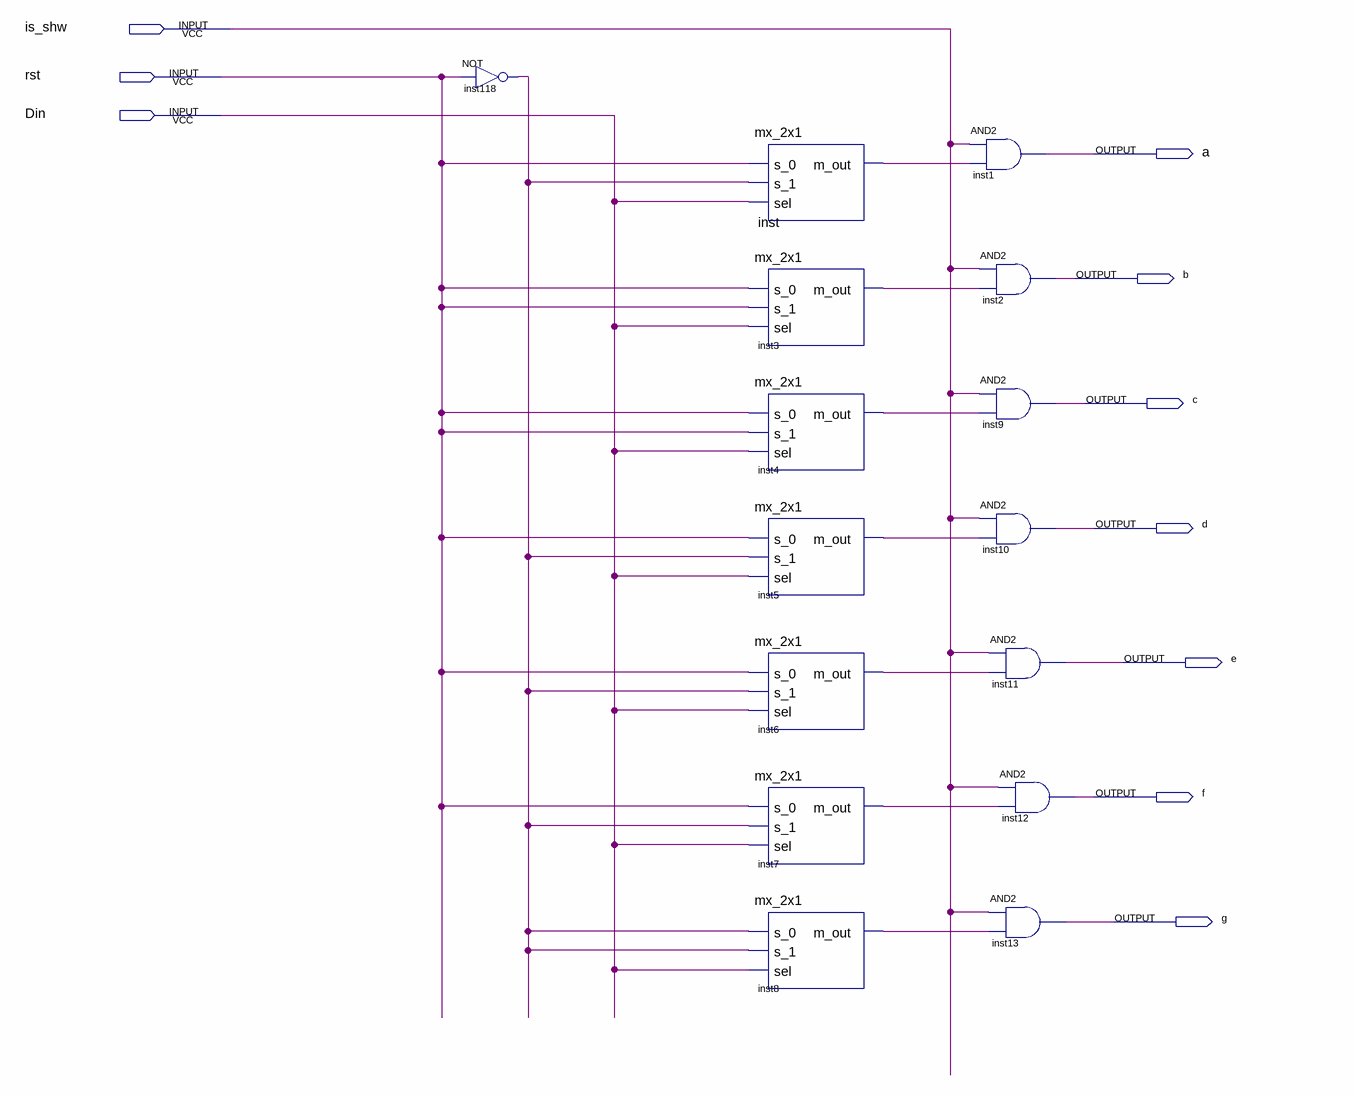
[diagram p0: schematic sheet]
// Quartus schematic b2seg.bdf as structural Verilog: 15 symbols, 10 pins
module b2seg (
  input  is_shw,
  input  rst,
  input  Din,
  output a,
  output b,
  output c,
  output d,
  output e,
  output f,
  output g
);

  wire inst3_m_out, inst4_m_out, inst5_m_out, inst6_m_out, inst7_m_out, inst8_m_out, inst118_out, inst_m_out;

  not inst118 (inst118_out, rst);
  mx_2x1 inst (.s_0(rst), .s_1(inst118_out), .sel(Din), .m_out(inst_m_out));
  mx_2x1 inst3 (.s_0(rst), .s_1(rst), .sel(Din), .m_out(inst3_m_out));
  mx_2x1 inst4 (.s_0(rst), .s_1(rst), .sel(Din), .m_out(inst4_m_out));
  mx_2x1 inst5 (.s_0(rst), .s_1(inst118_out), .sel(Din), .m_out(inst5_m_out));
  mx_2x1 inst6 (.s_0(rst), .s_1(inst118_out), .sel(Din), .m_out(inst6_m_out));
  mx_2x1 inst7 (.s_0(rst), .s_1(inst118_out), .sel(Din), .m_out(inst7_m_out));
  mx_2x1 inst8 (.s_0(inst118_out), .s_1(inst118_out), .sel(Din), .m_out(inst8_m_out));
  and inst1 (a, is_shw, inst_m_out);
  and inst2 (b, is_shw, inst3_m_out);
  and inst9 (c, is_shw, inst4_m_out);
  and inst10 (d, is_shw, inst5_m_out);
  and inst11 (e, is_shw, inst6_m_out);
  and inst13 (g, is_shw, inst8_m_out);
  and inst12 (f, is_shw, inst7_m_out);
endmodule
